# EAGLE design shield biasa (EAGLE 9.6.1)
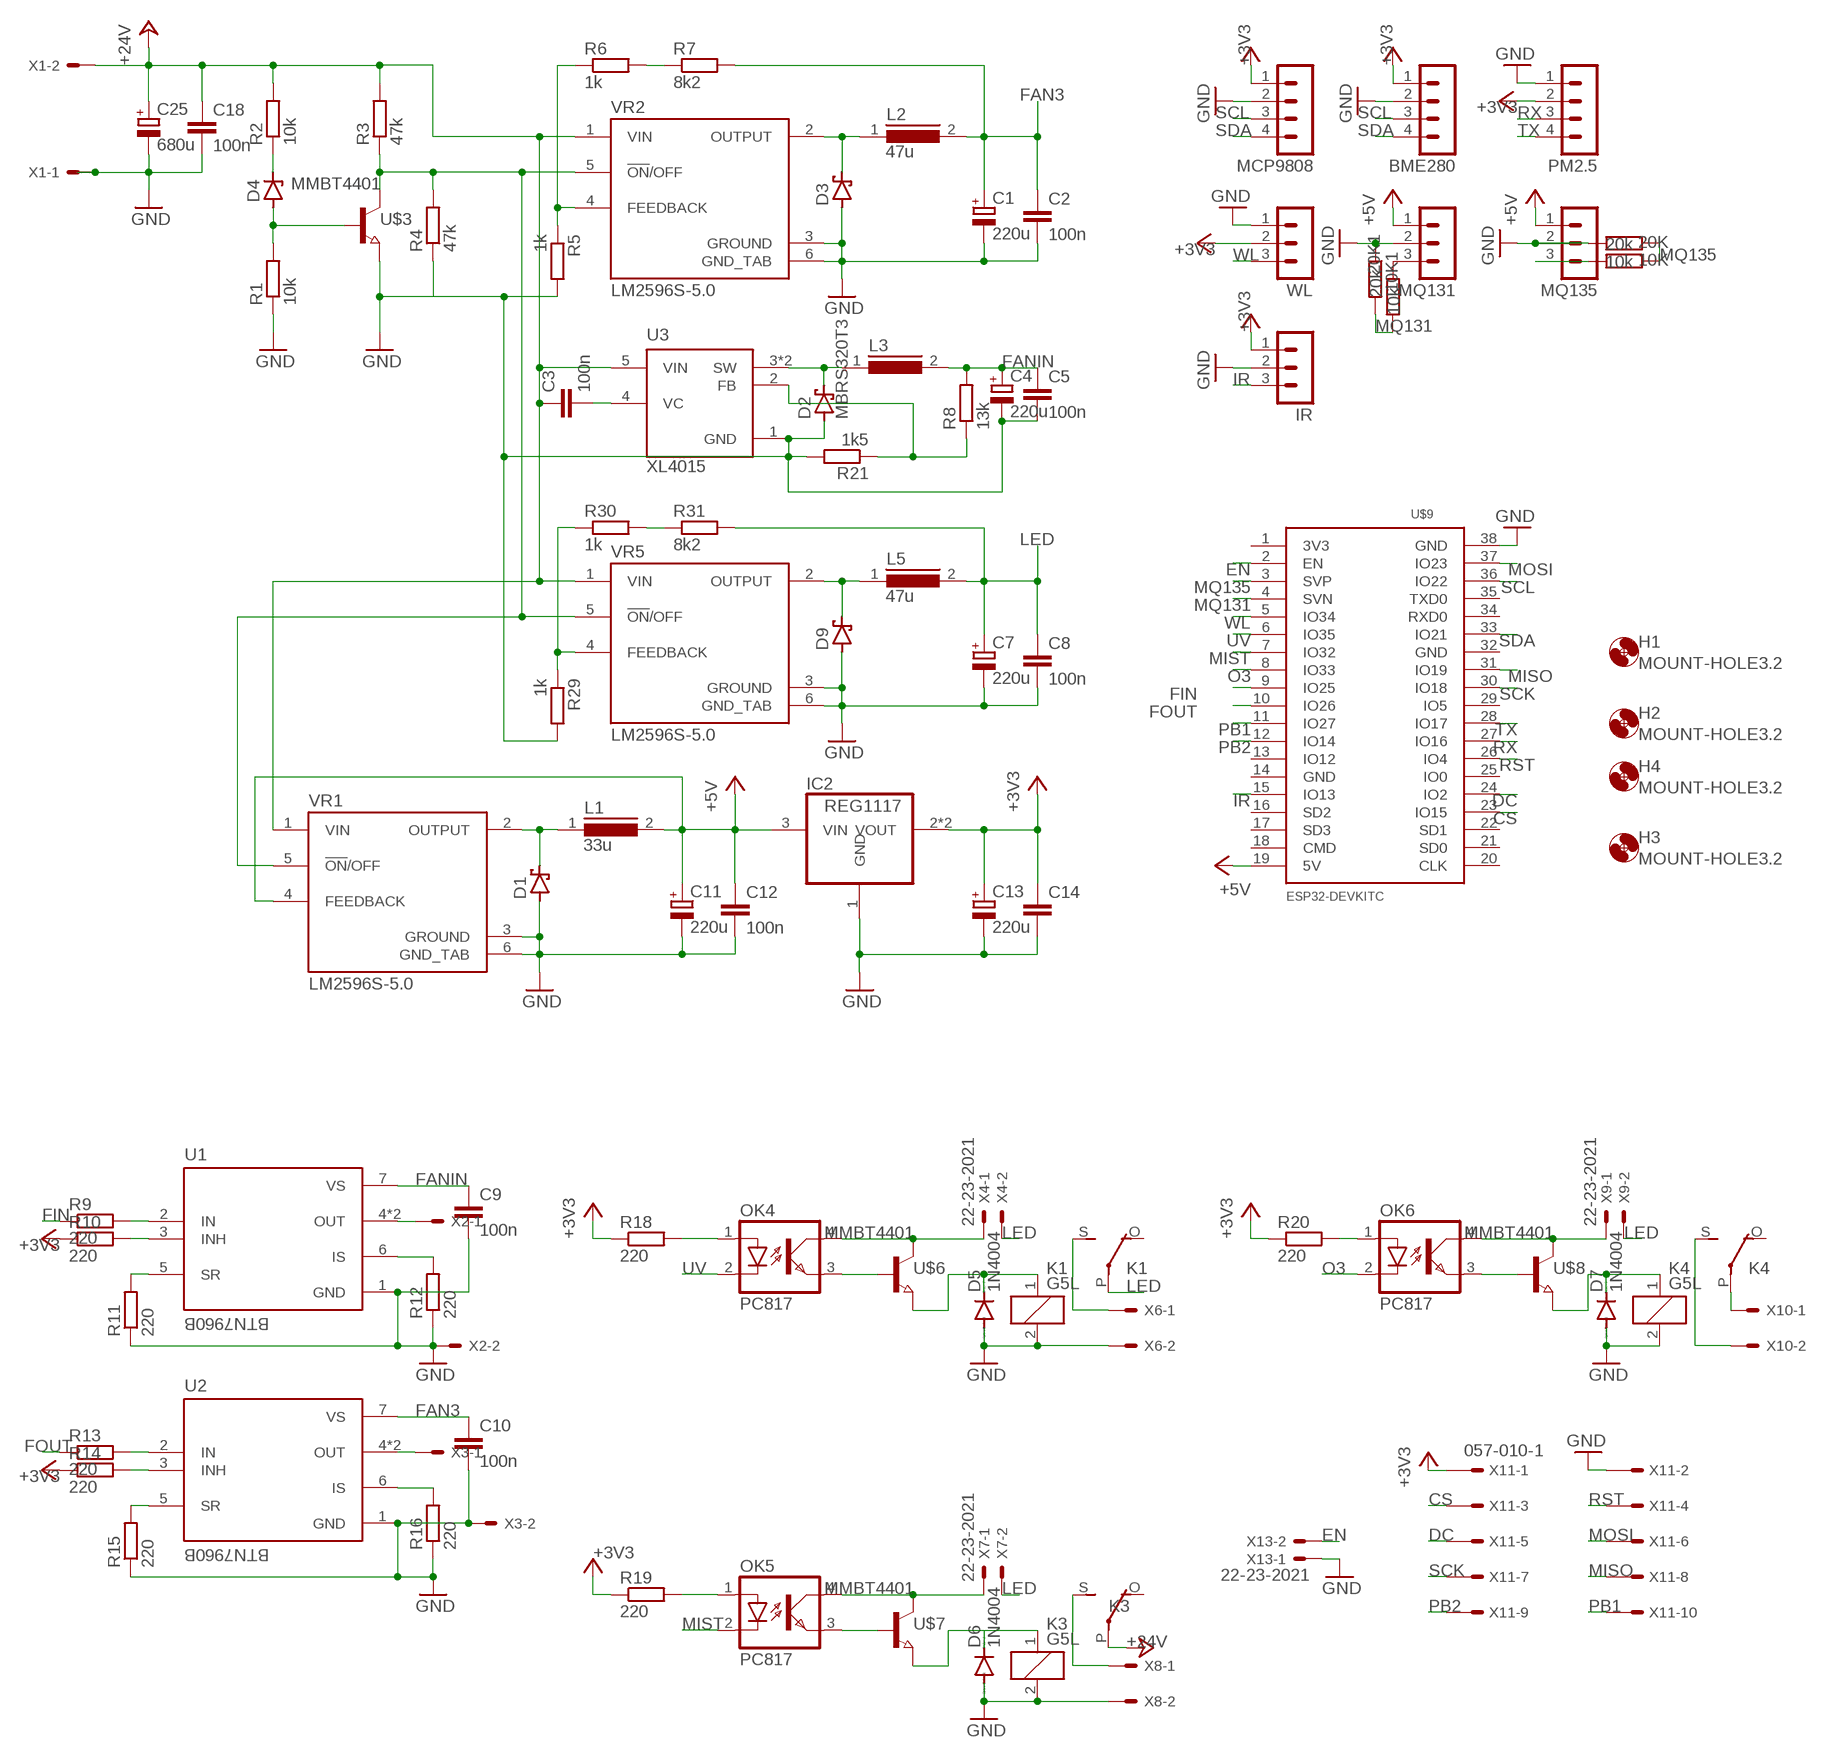
[diagram p0: schematic, sheet 1]

## Parts
10K  10k  R-EU_R0805  [R0805]
10K1  10k  R-EU_R0805  [R0805]
20K  20k  R-EU_R0805  [R0805]
20K1  20k  R-EU_R0805  [R0805]
BME280  MA04-1  [MA04-1]
C1  220u  CPOL-EU153CLV-0605  [153CLV-0605]
C2  100n  C-EUC0805  [C0805]
C3  100n  C-EUC0805  [C0805]
C4  220u  CPOL-EU153CLV-0605  [153CLV-0605]
C5  100n  C-EUC0805  [C0805]
C7  220u  CPOL-EU153CLV-0605  [153CLV-0605]
C8  100n  C-EUC0805  [C0805]
C9  100n  C-EUC0805  [C0805]
C10  100n  C-EUC0805  [C0805]
C11  220u  CPOL-EU153CLV-0605  [153CLV-0605]
C12  100n  C-EUC0805  [C0805]
C13  220u  CPOL-EU153CLV-0605  [153CLV-0605]
C14  100n  C-EUC0805  [C0805]
C18  100n  C-EUC0805  [C0805]
C25  680u  CPOL-EU150CLZ-1010  [150CLZ-1010]
D1  SCHOTTKY-DIODESMD  [SMB]
D2  MBRS320T3  [SMC]
D3  SCHOTTKY-DIODESMD  [SMB]
D4  ZENER-DIODESOD80C  [SOD80C]
D5  1N4004  [DO41-10]
D6  1N4004  [DO41-10]
D7  1N4004  [DO41-10]
D9  SCHOTTKY-DIODESMD  [SMB]
H1  MOUNT-HOLE3.2  [3,2]
H2  MOUNT-HOLE3.2  [3,2]
H3  MOUNT-HOLE3.2  [3,2]
H4  MOUNT-HOLE3.2  [3,2]
IC2  REG1117  [SOT223]
IR  MA03-1  [MA03-1]
K1  G5L  [G5LE]
K3  G5L  [G5LE]
K4  G5L  [G5LE]
L1  33u  DR125  [DR125]
L2  47u  DR125  [DR125]
L3  R1003DS11  [S11-10]
L5  47u  DR125  [DR125]
MCP9808  MA04-1  [MA04-1]
MQ131  MA03-1  [MA03-1]
MQ135  MA03-1  [MA03-1]
OK4  PC817  [DIL04]
OK5  PC817  [DIL04]
OK6  PC817  [DIL04]
PM2.5  MA04-1  [MA04-1]
R1  10k  R-EU_R0805  [R0805]
R2  10k  R-EU_R0805  [R0805]
R3  47k  R-EU_R0805  [R0805]
R4  47k  R-EU_R0805  [R0805]
R5  1k  R-EU_R0805  [R0805]
R6  1k  R-EU_R0805  [R0805]
R7  8k2  R-EU_R0805  [R0805]
R8  13k  R-EU_R0805  [R0805]
R9  220  R-EU_R0805  [R0805]
R10  220  R-EU_R0805  [R0805]
R11  220  R-EU_R0805  [R0805]
R12  220  R-EU_R0805  [R0805]
R13  220  R-EU_R0805  [R0805]
R14  220  R-EU_R0805  [R0805]
R15  220  R-EU_R0805  [R0805]
R16  220  R-EU_R0805  [R0805]
R18  220  R-EU_R0805  [R0805]
R19  220  R-EU_R0805  [R0805]
R20  220  R-EU_R0805  [R0805]
R21  1k5  R-EU_R0805  [R0805]
R29  1k  R-EU_R0805  [R0805]
R30  1k  R-EU_R0805  [R0805]
R31  8k2  R-EU_R0805  [R0805]
U1  BTN7960B  [IC_BTN7960B]
U2  BTN7960B  [IC_BTN7960B]
U3  XL4015  [CONV_XL4015]
U$3  MMBT4401  [SOT23-RAEDEN]
U$6  MMBT4401  [SOT23-RAEDEN]
U$7  MMBT4401  [SOT23-RAEDEN]
U$8  MMBT4401  [SOT23-RAEDEN]
U$9  ESP32DEVKITC  [ESP32-DEVKITC]
VR1  LM2596S-5.0  [TO170P1524X483-6N]
VR2  LM2596S-5.0  [TO170P1524X483-6N]
VR5  LM2596S-5.0  [TO170P1524X483-6N]
WL  MA03-1  [MA03-1]
X1  KK-156-2  [KK-156-2]
X2  KK-156-2  [KK-156-2]
X3  KK-156-2  [KK-156-2]
X4  22-23-2021  [22-23-2021]
X6  KK-156-2  [KK-156-2]
X7  22-23-2021  [22-23-2021]
X8  KK-156-2  [KK-156-2]
X9  22-23-2021  [22-23-2021]
X10  KK-156-2  [KK-156-2]
X11  057-010-1  [057-010-1]
X13  22-23-2021  [22-23-2021]

## Nets
+3V3 [24]: BME280.1 C13.+ C14.1 IC2.2(VOUT) IC2.4(VOUT) IR.1 MCP9808.1 PM2.5.2 R10.1 R14.1 R18.1 R19.1 R20.1 WL.2 X11.1
+5V: C11.+ C12.1 IC2.3(VIN) L1.2 MQ131.1 MQ135.1 U$9.19(5V) VR1.4(FEEDBACK)
+24V: C3.1 C18.1 C25.+ K3.P(2:P) R2.2 R3.2 U3.5(VIN) VR1.1(VIN) VR2.1(VIN) VR5.1(VIN) X1.2
CS [24]: U$9.23(IO15) X11.3
DC [24]: U$9.24(IO2) X11.5
EN [24]: U$9.2(EN) X13.2
FAN3 [24]: C1.+ C2.1 C10.1 L2.2 R7.2 U2.7(VS)
FANIN: C4.+ C5.1 C9.1 L3.2 R8.2 U1.7(VS)
FIN [24]: R9.1 U$9.9(IO25)
FOUT [24]: R13.1 U$9.10(IO26)
GND: 20K1.1 20K.2 BME280.2 C1.- C2.2 C4.- C5.2 C7.- C8.2 C9.2 C10.2 C11.- C12.2 C13.- C14.2 C18.2 C25.- D1.A D2.A D3.A D5.A D6.A D7.A D9.A IC2.1(GND) IR.2 K1.2 K3.2 K4.2 MCP9808.2 MQ131.2 MQ135.2 PM2.5.1 R1.1 R4.1 R5.2 R11.1 R12.1 R15.1 R16.1 R21.2 R29.2 U1.1(GND) U2.1(GND) U3.1(GND) U$3.E U$9.38(GND) VR1.3(GROUND) VR1.6(GND_TAB) VR2.3(GROUND) VR2.6(GND_TAB) VR5.3(GROUND) VR5.6(GND_TAB) WL.1 X1.1 X2.2 X3.2 X6.2 X8.2 X11.2 X13.1
IR: IR.3 U$9.15(IO13)
LED [24]: C7.+ C8.1 K1.P(2:P) L5.2 R31.2 X4.2 X7.2 X9.2
MISO [24]: U$9.31(IO19) X11.8
MIST [24]: OK5.2(C) U$9.7(IO32)
MOSI [24]: U$9.37(IO23) X11.6
MQ131: 10K1.2 20K1.2 U$9.4(SVN)
MQ135: 10K.1 20K.1 U$9.3(SVP)
N$1 [24]: D3.C L2.1 VR2.2(OUTPUT)
N$2 [24]: D4.A R1.2 U$3.B
N$3 [24]: D4.C R2.1
N$4: R9.2 U1.2(IN)
N$5: R10.2 U1.3(INH)
N$6: R11.2 U1.5(SR)
N$7 [24]: D1.C L1.1 VR1.2(OUTPUT)
N$8: 10K1.1 MQ131.3
N$9: C3.2 U3.4(VC)
N$10 [24]: OK4.1(A) R18.2
N$11 [24]: R5.1 R6.1 VR2.4(FEEDBACK)
N$12: R12.2 U1.6(IS)
N$13: OK4.4(COL) U$6.C X4.1
N$14: D2.C L3.1 U3.3(SW) U3.3.1(SW)
N$15: OK4.3(EMIT) U$6.B
N$16 [24]: D5.C K1.1 U$6.E
N$17: U1.4(OUT) U1.8(OUT) X2.1
N$18 [24]: K4.S(2:S) X10.2
N$19: R13.2 U2.2(IN)
N$20: R14.2 U2.3(INH)
N$21 [24]: K1.S(2:S) X6.1
N$22: R15.2 U2.5(SR)
N$23: 10K.2 MQ135.3
N$24 [24]: K4.P(2:P) X10.1
N$25: R16.2 U2.6(IS)
N$26 [24]: K3.S(2:S) X8.1
N$27: R8.1 R21.1 U3.2(FB)
N$28: U2.4(OUT) U2.8(OUT) X3.1
N$29 [24]: OK5.1(A) R19.2
N$33: OK6.3(EMIT) U$8.B
N$34: OK6.4(COL) U$8.C X9.1
N$35 [24]: D6.C K3.1 U$7.E
N$38 [24]: OK6.1(A) R20.2
N$40: OK5.3(EMIT) U$7.B
N$41 [24]: D7.C K4.1 U$8.E
N$42: OK5.4(COL) U$7.C X7.1
N$45: R6.2 R7.1
N$49 [24]: D9.C L5.1 VR5.2(OUTPUT)
N$50: R3.1 R4.2 U$3.C VR1.5(!ON!/OFF) VR2.5(!ON!/OFF) VR5.5(!ON!/OFF)
N$51: R29.1 R30.1 VR5.4(FEEDBACK)
N$53: R30.2 R31.1
O3 [24]: OK6.2(C) U$9.8(IO33)
PB1 [24]: U$9.11(IO27) X11.10
PB2 [24]: U$9.12(IO14) X11.9
RST [24]: U$9.26(IO4) X11.4
RX [24]: PM2.5.3 U$9.27(IO16)
SCK [24]: U$9.30(IO18) X11.7
SCL [24]: BME280.3 MCP9808.3 U$9.36(IO22)
SDA [24]: BME280.4 MCP9808.4 U$9.33(IO21)
TX [24]: PM2.5.4 U$9.28(IO17)
UV [24]: OK4.2(C) U$9.6(IO35)
WL [24]: U$9.5(IO34) WL.3
Unconnected: K1.O(2:O) K3.O(2:O) K4.O(2:O) U$9.1(3V3) U$9.13(IO12) U$9.14(GND) U$9.16(SD2) U$9.17(SD3) U$9.18(CMD) U$9.20(CLK) U$9.21(SD0) U$9.22(SD1) U$9.25(IO0) U$9.29(IO5) U$9.32(GND) U$9.34(RXD0) U$9.35(TXD0)

## Library data of the parts
10K 10K1 20K 20K1 R1-R16 R18-R21 R29-R31 = rcl:R-EU_: RESISTOR, European symbol; SPICEPREFIX: R
BME280 MCP9808 PM2.5 = con-lstb:MA04-1: PIN HEADER; OC_FARNELL: unknown; OC_NEWARK: unknown
C1 C4 C7 C11 C13 C25 = rcl:CPOL-EU: POLARIZED CAPACITOR, European symbol; SPICEPREFIX: C
C2 C3 C5 C8-C10 C12 C14 C18 = rcl:C-EU: CAPACITOR, European symbol; SPICEPREFIX: C
D1 D3 D9 = diode:SCHOTTKY-DIODE: Schottky Diode
D2 = diode:MBRS3*0T3: SCHOTTKY BARRIER RECTIFIER 3.0 AMPERES 20, 30, 40 VOLT Source: MBRS340T3-D.pdf
D4 = diode:ZENER-DIODE: Z-Diode
D5-D7 = diode:1N4004: DIODE general purpose rectifier, 1 A
H1-H4 = holes:MOUNT-HOLE: MOUNTING HOLE with drill center marker
IC2 = burr-brown:REG1117: 800mA and 1A Low Dropout (LDO) Positive Regulator 1.8V, 2.5V, 2.85V, 3.3V, 5V, and Adj; MPN: REG1117; OC_FARNELL: 1097566; OC_NEWARK: 14P6981
IR MQ131 MQ135 WL = con-lstb:MA03-1: PIN HEADER; OC_FARNELL: unknown; OC_NEWARK: unknown
K1 K3 K4 = relay:G5L: RELAY 1 x switch, 10 A/120 V AC, 8 A/30 V ADC, Omron; OC_FARNELL: unknown; OC_NEWARK: unknown
L1 L2 L5 = inductors:DR125: High Power Density, High Efficiency, Shielded Inductors Source: coiltronics_dr_series.pdf; SPICEPREFIX: L
L3 = inductor-nkl:R1003D: Speicherdrossel (bis typ. 250kHz) storage choke (up to typ. 250kHz); OC_FARNELL: unknown; OC_NEWARK: unknown
OK4-OK6 = optocoupler:PC817: SHARP OPTO COUPLER; MPN: PC817X4J000F; OC_FARNELL: 9707727; OC_NEWARK: 97K7059
U1 U2 = BTN7960B:BTN7960B: Motor Driver Power MOSFET On/Off PG-TO263-7 Check prices <https://pricing.snapeda.com/parts/BTN7960B/Infineon%20Technologies/view-part?ref=eda>; AVAILABILITY: Bad; DESCRIPTION: Motor Driver Power MOSFET On/Off PG-TO263-7; MF: Infineon Technologies; MP: BTN7960B; PACKAGE: TO-263-8 Infineon Technologies; PRICE: None
U3 = XL4015:XL4015: 5A 180KHz 36V Buck DC to DC Converter Check prices <https://pricing.snapeda.com/parts/XL4015/XLSEMI/view-part?ref=eda>; AVAILABILITY: Not in stock; DESCRIPTION: 5A 180KHz 36V Buck DC to DC Converter; MF: XLSEMI; MP: XL4015; PACKAGE: Package; PRICE: None
U$3 U$6-U$8 = MMBT4401:MMBT4401: MMBT4401 NPN Single SMD 4401 40V CE 600mA continuous See Fairchild Semi Check prices <https://pricing.snapeda.com/parts/MMBT4401/ON%20Semiconductor/view-part?ref=eda>; AVAILABILITY: Warning; DESCRIPTION: Bipolar (BJT) Transistor NPN 40V 600mA 250MHz 300mW Surface Mount SOT-23-3 (TO-236); MF: ON Semiconductor; MP: MMBT4401; PACKAGE: SOT-23 ON Semiconductor; PRICE: None; PURCHASE-URL: https://pricing.snapeda.com/search/part/MMBT4401/?ref=eda
U$9 = ESP32-DEVKITC:ESP32DEVKITC
VR1 VR2 VR5 = LM2596S-5.0:LM2596S-5.0: Check prices <https://pricing.snapeda.com/parts/LM2596S-5.0/NOPB/Texas%20Instruments/view-part?ref=eda>; AVAILABILITY: Good; DESCRIPTION: SIMPLE SWITCHER&reg; 4.5V to 40V, 3A Low Component Count Step-Down Regulator 5-DDPAK/TO-263; MF: Texas Instruments; MP: LM2596S-5.0/NOPB; PACKAGE: TO-263-5 Texas Instruments; PRICE: None; PURCHASE-URL: https://pricing.snapeda.com/search/part/LM2596S-5.0/NOPB/?ref=eda
X1-X3 X6 X8 X10 = con-molex:KK-156-2: KK 156 HEADER Source: http://www.molex.com/pdm_docs/sd/026604100_sd.pdf; MF: MOLEX; OC_FARNELL: unknown; OC_NEWARK: unknown
X4 X7 X9 X13 = con-molex:22-23-2021: .100" (2.54mm) Center Header - 2 Pin; MF: MOLEX; MPN: 22-23-2021; OC_FARNELL: 1462926; OC_NEWARK: 25C3832
X11 = con-panduit:057-010-: CONNECTOR 10-pin series 057 contact pc board low profile headers; OC_FARNELL: unknown; OC_NEWARK: unknown

## Board
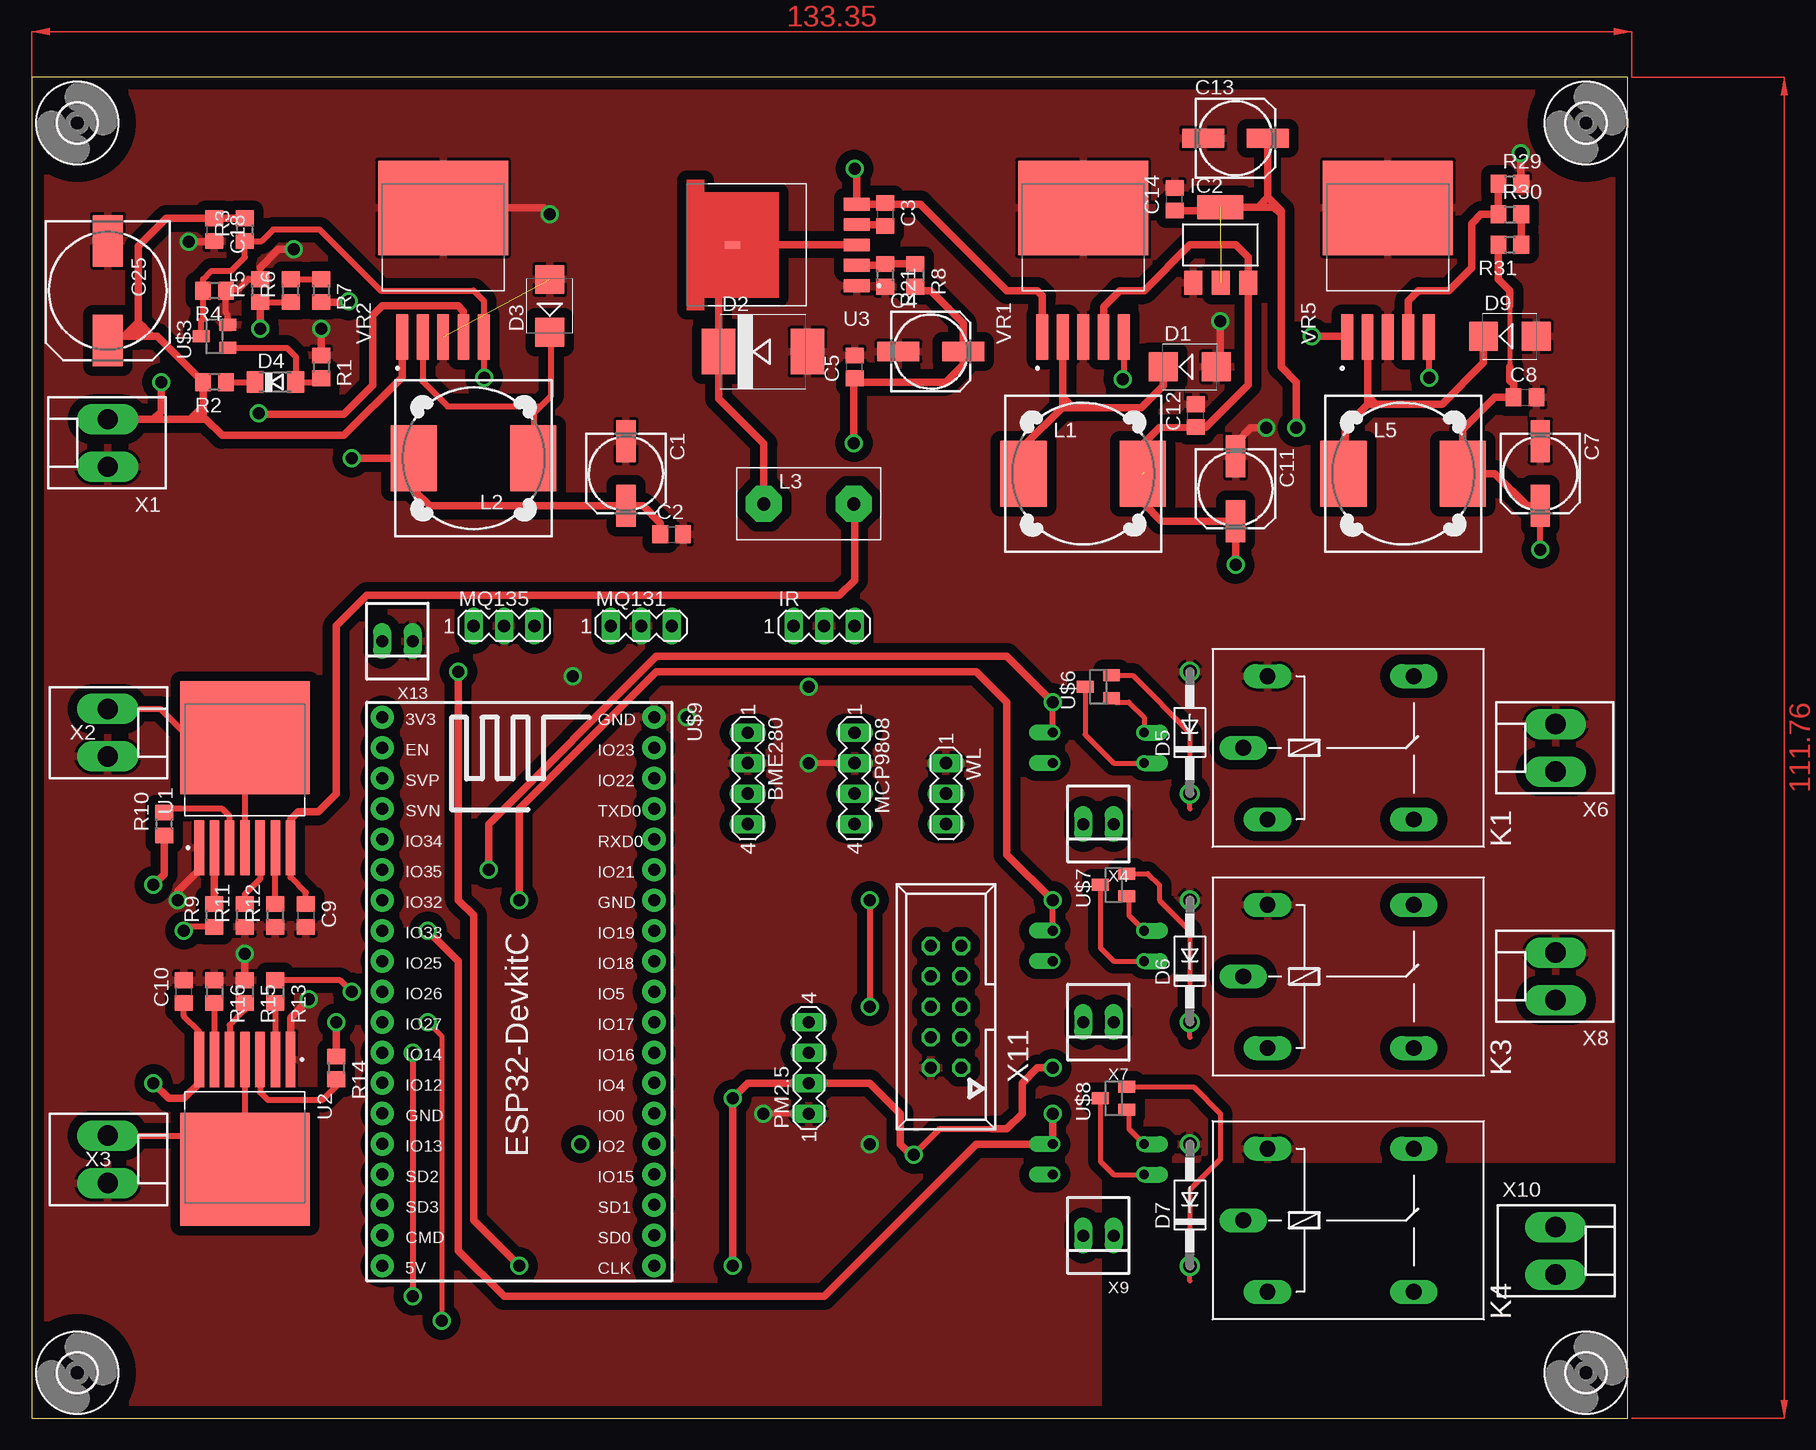
[diagram p1: board, top side]
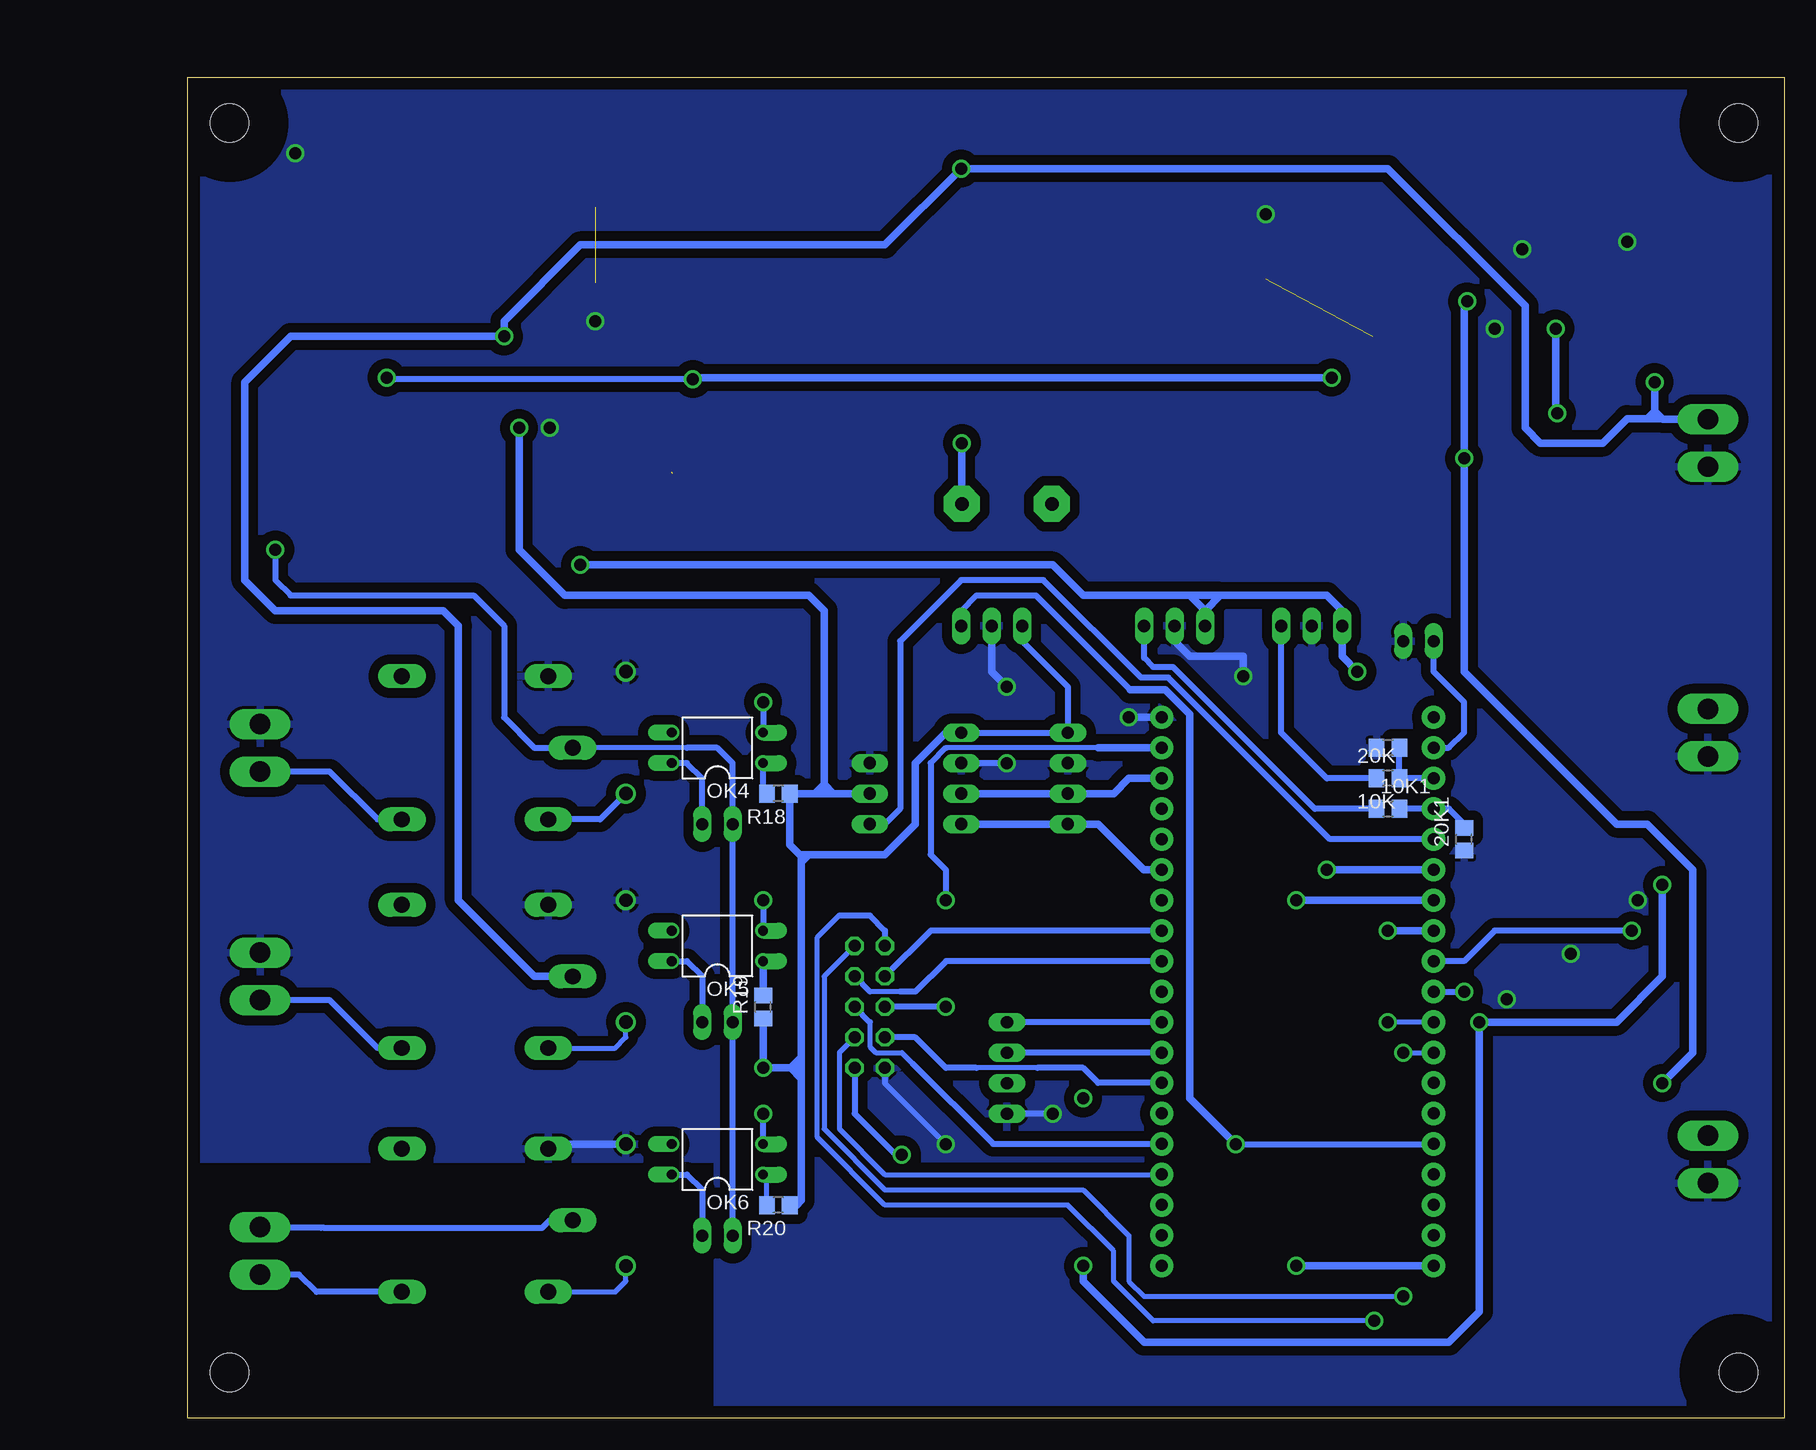
[diagram p2: board, bottom side, seen from below]

Size 133.02 x 111.75 mm. Coordinates in mm from the lower left corner, seen from the top.
Outline: 0,0 133.02,0 133.02,111.75 0,111.75 0,0
Copper layers (1*16): Top 0.035mm / dielectric 1.5mm / Bottom 0.035mm
Design rules "default": minimum track width 6mil, minimum drill 0.35mm, track to track 6mil, track to pad 6mil, pad to pad 6mil, via to via 6mil, smd to smd 6mil, copper to edge 40mil, drill to drill 6mil, minimum pad ring 10mil, minimum via ring 8mil, stop-mask expansion 4mil, vias tented up to drill 0mil, thermal gap 10mil

### Footprints (pad centres in the part's own frame; a part is rotated, then mirrored left to right if it is on the bottom)
R0805 = smd 1.3 x 1.5: 1 -0.95,0; 2 0.95,0
MA04-1 = drill 1.016 long: 1 -3.81,0; 2 -1.27,0; 3 1.27,0; 4 3.81,0
153CLV-0605 = smd 3.5 x 1.6: + 2.7,0; - -2.7,0
C0805 = smd 1.3 x 1.5: 1 -0.95,0; 2 0.95,0
150CLZ-1010 = smd 4.3 x 2.5: + 4.15,0; - -4.15,0
SMB = smd 2.4 x 2.4: A 2.2,0; C -2.2,0
SMC = smd 2.8 x 3.8: A 3.7,0; C -3.7,0
SOD80C = smd 1.4 x 1.8: A 1.7,0; C -1.7,0
DO41-10 = drill 1.118: A 5.08,0; C -5.08,0
3,2 = hole 3.2: 0,0
SOT223 = smd 1.499 x 2.007: 1 -2.261,-3.15; 2 0.025,-3.15; 3 2.311,-3.15 | smd 3.81 x 2.007: 4 0,3.15
MA03-1 = drill 1.016 long: 1 -2.54,0; 2 0,0; 3 2.54,0
G5LE = drill 1.321 long: 1 -7.493,-5.969; 2 -7.493,5.969; O 4.699,5.969; P -9.525,0; S 4.699,-5.969
DR125 = smd 3.85 x 5.5: 1 -4.975,0; 2 4.975,0
S11-10 = drill 1.1 pad 3 octagon: 1 -3.75,0; 2 3.75,0
DIL04 = drill 0.813 offset: 1 -1.27,-3.81; 2 1.27,-3.81; 3 1.27,3.81; 4 -1.27,3.81
IC_BTN7960B = smd 4.6 x 0.8: 1 -5.775,3.81; 2 -5.775,2.54; 3 -5.775,1.27; 4 -5.775,0; 5 -5.775,-1.27; 6 -5.775,-2.54; 7 -5.775,-3.81 | smd 9.4 x 10.8: 8 3.375,0
CONV_XL4015 = smd 2.16 x 1.07: 1 -10.335,3.4; 2 -10.335,1.7; 3 -10.335,0; 4 -10.335,-1.7; 5 -10.335,-3.4 | smd 1.27 x 0.635: 3.1 0,0
SOT23-RAEDEN = smd 1 x 1.4: B -0.95,-1.1; C 0,1.1; E 0.95,-1.1
ESP32-DEVKITC = drill 1 pad 1.93: 1 -22.87,-11.42; 2 -20.33,-11.42; 3 -17.79,-11.42; 4 -15.25,-11.42; 5 -12.71,-11.42; 6 -10.17,-11.42; 7 -7.63,-11.42; 8 -5.09,-11.42; 9 -2.55,-11.42; 10 -0.01,-11.42; 11 2.53,-11.42; 12 5.07,-11.42; 13 7.61,-11.42; 14 10.15,-11.42; 15 12.69,-11.42; 16 15.23,-11.42; 17 17.77,-11.42; 18 20.31,-11.42; 19 22.85,-11.42; 20 22.85,11.23; 21 20.31,11.23; 22 17.77,11.23; 23 15.23,11.23; 24 12.69,11.23; 25 10.15,11.23; 26 7.61,11.23; 27 5.07,11.23; 28 2.53,11.23; 29 -0.01,11.23; 30 -2.55,11.23; 31 -5.09,11.23; 32 -7.63,11.23; 33 -10.17,11.23; 34 -12.71,11.23; 35 -15.25,11.23; 36 -17.79,11.23; 37 -20.33,11.23; 38 -22.87,11.23
TO170P1524X483-6N = smd 3.79 x 0.99: 1 -6.4,3.4; 2 -6.4,1.7; 3 -6.4,0; 4 -6.4,-1.7; 5 -6.4,-3.4 | smd 7.88 x 10.84: 6 4.35,0
KK-156-2 = drill 1.7 pad 2.184 long: 1 -1.98,0; 2 1.98,0
22-23-2021 = drill 1 long: 1 -1.27,0; 2 1.27,0
057-010-1 = drill 1 octagon: 1 -5.08,-1.27; 2 -5.08,1.27; 3 -2.54,-1.27; 4 -2.54,1.27; 5 0,-1.27; 6 0,1.27; 7 2.54,-1.27; 8 2.54,1.27; 9 5.08,-1.27; 10 5.08,1.27

### Placement (x,y rotation side)
10K  33.02,53.34 180 bottom
10K1  33.02,50.8 0 bottom
20K  33.02,55.88 180 bottom
20K1  26.67,48.26 90 bottom
BME280  59.69,53.34 270 top
C1  49.53,78.74 270 top
C2  53.34,73.66 0 top
C3  71.12,100.33 270 top
C4  74.93,88.9 0 top
C5  68.58,87.63 90 top
C7  125.73,78.74 270 top
C8  124.46,85.09 0 top
C9  22.86,41.91 270 top
C10  12.7,35.56 90 top
C11  100.33,77.47 270 top
C12  97.03,83.57 90 top
C13  100.33,106.68 0 top
C14  95.25,101.6 90 top
C18  15.24,99.06 270 top
C25  6.35,93.98 270 top
D1  96.52,87.63 0 top
D2  60.96,88.9 0 top
D3  43.18,92.71 90 top
D4  20.32,86.36 0 top
D5  96.52,57.15 90 top
D6  96.52,38.1 90 top
D7  96.52,17.78 90 top
D9  123.19,90.17 0 top
H1  129.54,107.95 0 top
H2  129.54,3.81 0 top
H3  3.81,3.81 0 top
H4  3.81,107.95 0 top
IC2  99.06,97.79 0 top
IR  66.04,66.04 0 top
K1  110.49,55.88 0 top
K3  110.49,36.83 0 top
K4  110.49,16.51 0 top
L1  87.63,78.74 0 top
L2  36.83,80.01 180 top
L3  64.77,76.2 0 top
L5  114.3,78.74 0 top
MCP9808  68.58,53.34 270 top
MQ131  50.8,66.04 0 top
MQ135  39.37,66.04 0 top
OK4  88.9,55.88 90 bottom
OK5  88.9,39.37 90 bottom
OK6  88.9,21.59 90 bottom
PM2.5  64.77,29.21 90 top
R1  24.13,87.63 270 top
R2  15.24,86.36 180 top
R3  17.78,99.06 90 top
R4  15.24,93.98 180 top
R5  19.05,93.98 90 top
R6  21.59,93.98 90 top
R7  24.13,93.98 270 top
R8  73.66,95.25 270 top
R9  15.24,41.91 90 top
R10  11.05,49.53 90 top
R11  17.78,41.91 90 top
R12  20.32,41.91 90 top
R13  20.32,35.56 270 top
R14  25.4,29.21 270 top
R15  17.78,35.56 270 top
R16  15.24,35.56 270 top
R18  83.82,52.07 180 bottom
R19  85.09,34.29 90 bottom
R20  83.82,17.78 180 bottom
R21  71.12,95.25 270 top
R29  123.19,102.87 0 top
R30  123.19,100.33 0 top
R31  123.19,97.79 180 top
U1  17.78,53.34 90 top
U2  17.78,24.13 270 top
U3  58.42,97.79 180 top
U$3  15.24,90.17 90 top
U$6  88.9,60.96 90 top
U$7  90.17,44.45 90 top
U$8  90.17,26.67 90 top
U$9  40.64,35.56 270 top
VR1  87.63,96.52 90 top
VR2  34.29,96.52 90 top
VR5  113.03,96.52 90 top
WL  76.2,52.07 270 top
X1  6.35,81.28 90 top
X2  6.35,57.15 270 top
X3  6.35,21.59 270 top
X4  88.9,49.53 180 top
X6  127,55.88 90 top
X7  88.9,33.02 180 top
X8  127,36.83 90 top
X9  88.9,15.24 180 top
X10  127,13.97 270 top
X11  76.2,34.29 90 top
X13  30.48,64.77 180 top

### Tracks (layer width: path | path; a pad name or v marks a point on that pad's centre or on a via)
+3V3  (via drill 1)  (1 unrouted)
  Top 0.508: v73.53,21.97 75.69,24.13 80.01,24.13
  Top 0.61: 102.21,100.94 IC2.4 98.77,100.65 C14.1 | 103.03,101.76 C13.+ | 102.21,100.94 103.03,101.76 | R14.1 v25.4,33.02 | v10.16,44.45 11.05,45.34 R10.1 | v58.42,12.7 v58.42,26.67 59.69,27.94 PM2.5.2 69.85,27.94 72.39,25.4 72.39,22.86 73.28,21.97 v73.53,21.97 | 80.01,24.13 81.28,24.13 82.55,25.4 82.55,27.94 83.82,29.21 v85.09,29.21 | 104.14,100.33 104.14,87.63 105.41,86.36 v105.41,82.55 | 104.14,100.33 103.53,100.94 102.21,100.94 | 104.14,100.33 104.14,100.65 103.03,101.76
  Bottom 0.508: X11.1 77.47,25.4 74.04,21.97 v73.53,21.97 | MCP9808.1 BME280.1 59.69,60.96 63.5,64.77 IR.1
  Bottom 0.61: v10.16,44.45 10.16,36.83 13.97,33.02 v25.4,33.02 25.4,8.89 27.94,6.35 53.34,6.35 58.42,11.43 v58.42,12.7 | R20.1 82.3,17.78 81.91,18.16 81.91,28.32 | 82.55,51.75 R18.1 | 81.91,28.32 81.91,29.21 | 81.91,29.21 81.91,30.1 | 81.91,30.1 81.91,46.36 | 81.91,46.36 81.91,46.86 82.87,47.82 R18.1 | R19.1 v85.09,29.21 82.8,29.21 | WL.2 79.25,52.07 | 79.25,52.07 80.01,52.07 | 80.01,52.07 80.77,52.07 | 80.77,52.07 R18.1 | 80.01,52.07 80.01,52.83 | 80.01,52.83 80.01,67.31 81.28,68.58 101.6,68.58 105.41,72.39 v105.41,82.55 | MCP9808.1 69.85,57.15 72.39,54.61 72.39,49.53 74.93,46.99 81.28,46.99 | 81.28,46.99 81.91,46.99 | 81.28,46.99 81.91,46.36 | 80.77,52.07 80.01,52.83 | 80.01,52.83 79.25,52.07 | 82.8,29.21 81.91,29.21 | 81.91,28.32 82.8,29.21 | 82.8,29.21 81.91,30.1
+5V  (via drill 1)  (1 unrouted)
  Top 0.508: 92.71,76.2 92.71,77.47 | 91.44,78.74 91.54,78.84 92.71,78.84
  Top 0.61: VR1.4 89.33,92.63 90.68,93.98 92.71,93.98 96.52,97.79 100.33,97.79 101.37,96.75 IC2.3 101.37,86.13 97.86,82.62 C12.1 93.98,82.55 92.6,81.17 L1.2 92.71,78.64 92.71,76.2 94.14,74.77 C11.+ v100.33,71.12 | v40.64,12.7 36.83,16.51 36.83,41.91 35.56,43.18 v35.56,62.23
  Bottom 0.61: 48.26,67.31 46.99,68.58 | 46.99,68.58 38.1,68.58 36.83,67.31 MQ135.1 36.83,63.5 v35.56,62.23 | v100.33,71.12 60.96,71.12 58.42,68.58 49.53,68.58 | 46.99,68.58 49.53,68.58 | U$9.19 v40.63,12.71 v40.64,12.7 | MQ131.1 48.26,67.31 | 48.26,67.31 49.53,68.58
+24V  (via drill 1)
  Top 0.508: 8.13,90.68 8.89,91.44 9.46,90.87 | 9.46,90.87 10.16,90.17 | 7.62,90.17 8.13,90.68 | 8.13,90.68 8.89,90.68 9.27,90.68 9.46,90.87
  Top 0.61: C25.+ 6.69,90.17 7.62,90.17 8.89,90.17 | 8.89,90.17 8.89,90.68 8.89,91.44 8.89,97.66 11.24,100.01 C18.1 R3.2 | 8.89,90.17 10.16,90.17 10.48,90.17 R2.2 14.29,84.33 | VR2.1 30.89,86.77 26.04,81.92 15.88,81.92 14.53,83.26 | 14.53,83.26 14.29,83.5 | 14.29,83.5 14.29,84.33 | X1.2 10.16,83.26 | 10.16,83.26 13.22,83.26 | 13.22,83.26 14.53,83.26 | 13.22,83.26 13.88,83.91 | 13.88,83.91 14.29,84.33 | 13.88,83.91 14.29,83.5 | 10.16,83.26 10.79,83.89 v10.79,86.36 | 71.03,101.19 U3.5 68.75,103.97 v68.58,104.14 | 71.03,101.19 C3.1 | VR1.1 84.23,93.57 83.82,93.98 81.28,93.98 74.07,101.19 71.03,101.19 | VR5.1 109.58,90.17 v106.68,90.17
  Bottom 0.61: v10.79,86.36 10.79,83.95 | X1.2 10.11,83.26 10.16,83.31 | 10.16,83.31 10.79,83.95 | K3.P 104.14,36.83 110.49,43.18 110.49,66.04 111.76,67.31 125.73,67.31 128.27,69.85 128.27,86.36 124.46,90.17 v106.68,90.17 106.68,91.44 100.33,97.79 74.93,97.79 v68.58,104.14 33.02,104.14 21.59,92.71 21.59,82.55 20.32,81.28 15.11,81.28 13.08,83.31 11.43,83.31 | 11.43,83.31 10.16,83.31 | 10.79,83.95 11.43,83.31
CS
  Bottom 0.406: X11.3 78.74,30.48 78.74,24.13 74.93,20.32 U$9.23
  Bottom 0.508: U$9.23
DC
  Bottom 0.406: 72.64,29.59 73.53,30.48 75.69,30.48 76.2,30.99 76.2,33.02
  Bottom 0.508: X11.5 76.2,33.02 | 72.64,29.59 65.92,22.87 U$9.24
EN
  Bottom 0.508: U$9.2 27.93,55.89 26.67,57.15 26.67,59.69 29.21,62.23 X13.2
FAN3  (via drill 1)
  Top 0.508: U2.7 13.97,30.48 13.97,32.26 12.7,33.53 C10.1
  Top 0.61: R7.2 26.35,93.03 v26.42,93.09 | v26.67,80.01 L2.2 31.85,77.36 33.18,76.04 C1.+ 50.96,76.04 52.39,74.61 C2.1 | v10.16,27.94 11.43,26.67 12.7,26.67 13.97,27.94 13.97,30.48
  Bottom 0.61: v26.42,93.09 26.67,92.84 v26.67,80.01 26.67,62.23 13.97,49.53 11.43,49.53 7.62,45.72 7.62,30.48 v10.16,27.94
FANIN  (via drill 1)
  Top 0.508: C9.1 22.86,43.81 21.59,45.08 U1.7
  Top 0.61: R8.2 73.98,93.98 74.93,93.98 77.63,91.28 C4.+ 77.63,87.79 76.2,86.36 68.9,86.36 C5.1 68.52,86.62 v68.52,81.28 | U1.7 21.59,49.91 22.23,50.55 23.88,50.55 25.4,52.07 25.4,66.04 27.94,68.58 67.31,68.58 68.58,69.85 68.58,76.14 L3.2
  Bottom 0.61: L3.2 v68.52,81.28
FIN  (via drill 1)
  Top 0.508: R9.1 13.02,40.96 v12.7,40.64
  Bottom 0.508: v12.7,40.64 24.13,40.64 26.67,38.1 U$9.9
FOUT  (via drill 1)
  Top 0.508: v26.67,35.56 25.72,36.51 R13.1
  Bottom 0.508: U$9.10 v26.68,35.57 v26.67,35.56
GND  (via drill 1)  (1 unrouted)
  Top 0.508: PM2.5.1 v60.96,25.4 | R5.2 18.09,94.93 17.27,94.11 16.32,94.11 R4.1 16.19,92.14 16.34,91.99 U$3.E | MCP9808.2 v64.77,54.61
  Top 0.61: R1.1 v24.13,90.81 | C18.2 15.17,98.04 v13.08,98.04 | VR2.6 42.64,100.87 v43.18,100.33 | C11.- 100.33,81.28 101.6,82.55 v102.87,82.55 | D1.A 99.06,87.97 v99.06,91.44 | v21.84,97.41 20.57,97.41 19.05,95.89 | v124.08,105.41 124.08,102.93 R29.2 | R15.1 v17.78,38.73 | U1.1 13.97,45.72 12.19,43.94 v12.19,43.18 | U2.1 21.59,33.4 v23.11,34.92
  Bottom 0.406: 74.93,27.94 v69.85,22.86
  Bottom 0.508: v60.96,25.4 PM2.5.1 | X11.2 74.93,27.94 | v64.77,54.61 MCP9808.2
  Bottom 0.61: K4.2 102.62,22.86 D7.A | U$9.38 v54.6,58.43 v54.61,58.42 | IR.2 66.04,62.23 v64.77,60.96 | MQ131.2 50.8,64.77 49.53,63.5 45.09,63.5 v45.09,61.86
  pour Top (isolate 0.813): 0,111.76 132.97,111.76 132.97,21.59 88.9,21.59 88.9,0 0,0
  pour Bottom (isolate 0.813): 0,111.76 133.35,111.76 133.35,21.59 88.9,21.59 88.9,0 0,0
IR  (via drill 1)
  Bottom 0.508: IR.3 68.58,67.31 67.31,68.58 62.36,68.58 54.48,60.71 | v45.72,22.86 U$9.15
  Bottom 0.61: 54.48,60.71 51.56,60.71 49.53,58.67 49.53,26.67 v45.72,22.86
LED  (via drill 1)
  Top 0.406: 123.19,92.71 123.19,87.63
  Top 0.508: v125.73,72.39 C7.+
  Top 0.61: R31.2 122.24,94.93 123.19,93.98 123.19,92.71 | 123.19,87.63 123.19,86.49 123.51,86.17 C8.1 121.92,85.09 119.27,82.44 L5.2 121.92,78.74 124.62,76.04 C7.+
  Bottom 0.406: 91.44,55.88 101.6,55.88
  Bottom 0.508: X9.2 X7.2 X4.2 87.63,54.61 88.9,55.88 91.44,55.88 | v125.73,72.39 125.73,69.85 124.46,68.58 109.22,68.58 106.68,66.04 106.68,58.42 104.14,55.88 101.6,55.88 K1.P
MISO
  Bottom 0.508: U$9.31 71.11,40.65 X11.8
MIST  (via drill 1)
  Top 0.508: OK5.2 v85.09,43.18
  Top 0.61: v40.64,43.18 40.64,50.8 52.07,62.23 78.74,62.23 81.28,59.69 81.28,46.99 v85.09,43.18
  Bottom 0.508: v85.09,43.18 OK5.2
  Bottom 0.61: U$9.7 v40.63,43.19 v40.64,43.18
MOSI  (via drill 1)
  Top 0.508: v69.85,43.18 v69.85,34.29
  Bottom 0.406: 57.15,55.88 69.85,55.88
  Bottom 0.508: v69.85,34.29 X11.6 | 69.85,55.88 71.12,54.61 71.12,46.99 69.85,45.72 v69.85,43.18
  Bottom 0.61: U$9.37 57.14,55.89 57.15,55.88
MQ131
  Bottom 0.508: 20K1.2 26.67,49.53 27.95,50.81 U$9.4 10K1.2
MQ135
  Bottom 0.508: U$9.3 10K.1 20K.1
N$1
  Top 0.508: VR2.2 32.59,86.41 34.67,84.33 40.64,84.33 41.4,84.33 | 42.42,84.33 43.31,85.22 43.31,90.38 D3.C | 41.4,84.33 41.91,84.33 | 41.91,84.33 42.42,84.33 | L2.1 41.91,80.11 41.91,83.82 | 41.91,84.33 41.91,83.82 | 41.91,83.82 42.42,84.33 | 41.91,83.82 41.4,84.33
N$2
  Top 0.508: U$3.B 21.27,89.22 22.02,88.47 D4.A 23.81,86.36 R1.2
N$3
  Top 0.508: R2.1 D4.C
N$4
  Top 0.61: U1.2 R9.2
N$5
  Top 0.508: 10.73,50.8 R10.2 11.37,50.8 15.88,50.8 16.51,50.17 U1.3
  Top 0.61: U1.3 16.51,49.53
N$6
  Top 0.508: U1.5 19.05,44.96 17.78,43.69 R11.2
N$7
  Top 0.61: VR1.2 85.93,85.09 | 85.93,84.28 85.93,84.2 86.82,84.2 | 85.93,85.09 85.93,84.28 | L1.1 82.66,81 85.93,84.28 | D1.C 94.32,86.06 92.46,84.2 86.82,84.2 | 85.93,85.09 86.82,84.2
N$8
  Bottom 0.508: MQ131.3 53.34,63.37 52.58,62.61 50.93,62.61 39.12,50.8 10K1.1
N$9
  Top 0.61: U3.4 71.01,99.49 C3.2
N$10
  Bottom 0.508: R18.2 85.09,52.39 OK4.1
N$11  (via drill 1)
  Top 0.508: R5.1 R6.1
  Top 0.61: VR2.4 35.99,92.28 35.56,92.71 29.21,92.71 28.45,91.95 28.45,86.11 26.04,83.69 18.92,83.69 v18.92,83.76 | v19.05,90.81 R5.1
  Bottom 0.61: v18.92,83.76 19.05,83.88 v19.05,90.81
N$12
  Top 0.508: R12.2 U1.6
N$13
  Top 0.406: U$6.C 87.8,56.98 90.17,54.61 OK4.4 93.98,54.61
  Bottom 0.508: X4.1 90.17,53.34 91.44,54.61 OK4.4 92.88,54.78
N$14
  Top 0.61: U3.3 U3.3.1 57.15,97.79 57.26,97.68 D2.C 57.26,84.98 61.02,81.22 L3.1
N$15
  Top 0.406: U$6.B 90.32,59.69 91.44,59.69 92.71,58.42 OK4.3 93.98,57.15
N$16
  Top 0.406: U$6.E 91.76,61.91 96.52,57.15 D5.C 96.52,50.8
  Bottom 0.508: K1.1 98.68,49.91 D5.C
N$17
  Top 0.508: U1.4 U1.8 13.13,56.72 10.72,59.13 X2.1
N$18
  Bottom 0.508: K4.S 122.3,10.54 123.75,11.99 X10.2
N$19
  Top 0.508: R13.2 U2.2
N$20
  Top 0.508: U2.3 19.05,27.18 19.68,26.54 24.26,26.54 25.4,27.69 R14.2
N$21
  Bottom 0.508: K1.S 117.22,49.91 121.21,53.9 X6.1
N$22
  Top 0.508: R15.2 17.78,34.04 16.51,32.77 U2.5
N$23
  Bottom 0.508: 10K.2 38.1,53.34 41.91,57.15 MQ135.3
N$24
  Bottom 0.508: X10.1 126.92,15.88 121.92,15.88 121.67,15.88 103.5,15.88 102.87,16.51 K4.P
N$25
  Top 0.508: R16.2 U2.6
N$26
  Bottom 0.508: K3.S 117.22,30.86 121.21,34.85 X8.1
N$27
  Top 0.61: U3.2 71.01,96.09 R21.1 R8.1
N$28
  Top 0.508: X3.1 14.96,23.57 U2.8 U2.4
N$29
  Bottom 0.508: 84.77,37.78 OK5.1
  Bottom 0.61: R19.2 OK5.1
N$33
  Top 0.406: U$8.B 91.44,25.55 91.44,24.13 OK6.3 93.98,22.86
N$34
  Top 0.406: U$8.C 89.07,21.42 90.17,20.32 OK6.4 93.98,20.32
  Bottom 0.508: OK6.4 91.44,20.32 90.17,19.05 X9.1
N$35
  Top 0.406: U$7.E 93.03,45.4 93.98,44.45 93.98,43.18 96.52,40.64 D6.C 96.52,31.75
  Bottom 0.406: K3.1 97.41,30.86 96.52,31.75 D6.C
N$38
  Bottom 0.406: R20.2 84.77,20 OK6.1
  Bottom 0.508: R20.2 85.09,18.1
N$40
  Top 0.406: U$7.B 91.44,43.33 91.44,41.91 OK5.3 93.98,40.64
N$41
  Top 0.406: U$8.E 96.84,27.62 99.06,25.4 99.06,21.59 96.52,19.05 D7.C 96.52,11.43
  Bottom 0.406: K4.1 97.41,10.54 96.52,11.43 D7.C
N$42
  Top 0.406: U$7.C 89.07,39.2 90.17,38.1 OK5.4 93.98,38.1
  Bottom 0.508: OK5.4 91.44,38.1 90.17,36.83 X7.1
N$45
  Top 0.508: R6.2 R7.1
N$49
  Top 0.61: VR5.2 111.33,85.09 | 111.33,85.09 111.33,84.53 | L5.1 109.47,78.89 109.47,82.68 111.33,84.53 | D9.C 120.99,87.97 117.55,84.53 112.01,84.53 | 112.01,84.53 111.33,84.53 | 111.33,85.09 111.46,85.09 112.01,84.53
N$50  (via drill 1)
  Top 0.508: U$3.C 14.14,91.48 14.29,91.63 R4.2 14.29,94.94 14.99,95.63 16.64,95.63 17.78,96.77 R3.1 19.18,98.11 20.13,99.06 24,99.06 29.08,93.98 36.83,93.98 37.69,93.12 VR2.5 37.72,90.09 v37.72,86.74 | VR1.5 91.03,86.71 v90.93,86.61 | v116.46,86.74 116.46,90.09 VR5.5
  Bottom 0.508: v90.93,86.61 116.33,86.61 v116.46,86.74 | 37.85,86.61 v37.72,86.74
  Bottom 0.61: v37.72,86.74 90.8,86.74 v90.93,86.61
N$51
  Top 0.61: R29.1 R30.1 120.78,100.33 120.01,99.57 120.01,95.89 118.11,93.98 115.57,93.98 114.73,93.14 VR5.4
N$53
  Top 0.61: R30.2 R31.1
O3  (via drill 1)
  Top 0.61: v33.02,40.64 35.56,38.1 35.56,13.97 39.37,10.16 66.04,10.16 78.74,22.86 OK6.2 v85.09,25.4
  Bottom 0.508: OK6.2 v85.09,25.4
  Bottom 0.61: U$9.8 v33.02,40.64
PB1  (via drill 1)
  Top 0.406: v33.02,33.02 34.16,31.88 v34.16,8.13
  Bottom 0.406: U$9.11 31.74,33.03 | 31.75,33.02 31.74,33.03 | 31.74,33.03 v33.01,33.03 v33.02,33.02 | v34.16,8.13 52.58,8.13 55.88,11.43 55.88,13.97 59.69,17.78 74.93,17.78 80.57,23.42 80.57,40.08 78.74,41.91
  Bottom 0.508: X11.10 74.93,40.64 76.2,41.91 78.74,41.91
PB2  (via drill 1)
  Top 0.508: v31.75,30.48 v31.75,10.16
  Bottom 0.406: v31.75,10.16 53.34,10.16 54.61,11.43 54.61,15.24 58.42,19.05 74.93,19.05 80.01,24.13 80.01,36.83 X11.9 | v31.75,30.48 U$9.12
RST
  Bottom 0.406: 62.23,29.21 67.31,29.21
  Bottom 0.508: U$9.26 57.16,27.95 58.42,29.21 62.23,29.21 | 67.31,29.21 69.85,29.21 72.39,31.75 X11.4
RX
  Bottom 0.508: U$9.27 PM2.5.3
SCK
  Bottom 0.406: 73.66,35.56 76.2,35.56
  Bottom 0.508: U$9.30 69.84,38.11 72.39,35.56 73.66,35.56 | 76.2,35.56 X11.7
SCL
  Bottom 0.61: MCP9808.3 BME280.3 55.88,52.07 54.6,53.35 U$9.36
SDA
  Bottom 0.61: MCP9808.4 BME280.4 57.15,49.53 53.35,45.73 U$9.33
TX
  Bottom 0.508: U$9.28 PM2.5.4
UV  (via drill 1)
  Top 0.508: OK4.2 v85.09,59.69
  Top 0.61: v38.1,45.72 38.1,49.53 52.07,63.5 81.28,63.5 v85.09,59.69
  Bottom 0.508: v85.09,59.69 OK4.2
  Bottom 0.61: U$9.6 v38.09,45.73 v38.1,45.72
WL
  Bottom 0.508: U$9.5 37.86,48.27 51.31,61.72 53.59,61.72 61.72,69.85 68.58,69.85 73.66,64.77 73.66,50.8 74.93,49.53 WL.3
(copper drawn outside any net)
  shapes: Top area x2